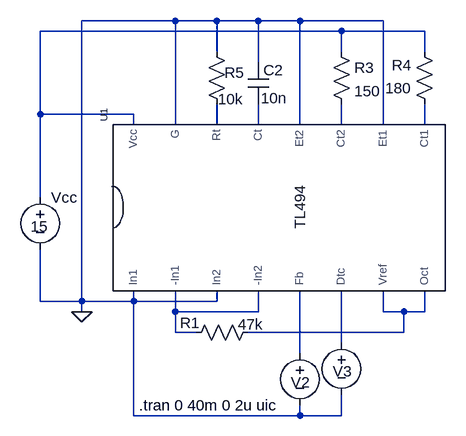
[diagram p0: schematic 494_test.asc]
494_test.asc, the LTspice schematic file:
Version 4
SHEET 1 880 764
WIRE -688 128 -832 128
WIRE -624 128 -688 128
WIRE -560 128 -624 128
WIRE -496 128 -560 128
WIRE -368 128 -496 128
WIRE -432 144 -896 144
WIRE -304 144 -432 144
WIRE -624 176 -624 128
WIRE -432 176 -432 144
WIRE -304 176 -304 144
WIRE -560 192 -560 128
WIRE -896 272 -896 144
WIRE -752 272 -896 272
WIRE -752 288 -752 272
WIRE -688 288 -688 128
WIRE -624 288 -624 256
WIRE -560 288 -560 256
WIRE -496 288 -496 128
WIRE -432 288 -432 256
WIRE -368 288 -368 128
WIRE -304 288 -304 256
WIRE -896 400 -896 272
WIRE -896 560 -896 480
WIRE -832 560 -832 128
WIRE -832 560 -896 560
WIRE -752 560 -752 544
WIRE -752 560 -832 560
WIRE -624 560 -624 544
WIRE -624 560 -752 560
WIRE -832 576 -832 560
WIRE -688 576 -688 544
WIRE -560 576 -560 544
WIRE -560 576 -688 576
WIRE -368 576 -368 544
WIRE -336 576 -368 576
WIRE -304 576 -304 544
WIRE -304 576 -336 576
WIRE -688 608 -688 576
WIRE -656 608 -688 608
WIRE -336 608 -336 576
WIRE -336 608 -576 608
WIRE -432 624 -432 544
WIRE -496 640 -496 544
WIRE -752 736 -752 560
WIRE -496 736 -496 720
WIRE -496 736 -752 736
WIRE -432 736 -432 704
WIRE -432 736 -496 736
FLAG -832 576 0
SYMBOL res -448 160 R0
SYMATTR InstName R3
SYMATTR Value 150
SYMBOL res -288 272 R180
WINDOW 0 36 76 Left 0
WINDOW 3 36 40 Left 0
SYMATTR InstName R4
SYMATTR Value 180
SYMBOL res -672 624 R270
WINDOW 0 15 7 VTop 0
WINDOW 3 44 100 VBottom 0
SYMATTR InstName R1
SYMATTR Value 47k
SYMBOL voltage -496 624 R0
WINDOW 3 24 104 Invisible 0
WINDOW 123 0 0 Left 0
WINDOW 39 0 0 Left 0
WINDOW 0 -14 61 Left 0
SYMATTR Value PULSE(0.7 5 10m 10m 50n 0 20m)
SYMATTR InstName V2
SYMBOL voltage -432 608 R0
WINDOW 3 24 104 Invisible 0
WINDOW 123 0 0 Left 0
WINDOW 39 0 0 Left 0
WINDOW 0 -13 60 Left 0
SYMATTR Value PULSE(0 5 0 10m 50n 0 20m)
SYMATTR InstName V3
SYMBOL res -640 160 R0
WINDOW 0 28 48 Left 0
WINDOW 3 18 89 Left 0
SYMATTR InstName R5
SYMATTR Value 10k
SYMBOL cap -576 192 R0
WINDOW 0 24 12 Left 0
WINDOW 3 20 55 Left 0
SYMATTR InstName C2
SYMATTR Value 10n
SYMBOL voltage -896 384 R0
WINDOW 123 0 0 Left 0
WINDOW 39 0 0 Left 0
WINDOW 0 17 16 Left 0
WINDOW 3 -15 61 Left 0
SYMATTR InstName Vcc
SYMATTR Value 15
SYMBOL TL494 -496 416 R270
SYMATTR InstName U1
TEXT -744 720 Left 0 !.tran 0 40m 0 2u uic

The netlist it stands for:
* 494_test.asc
R3 N001 N004 150
R4 N005 N001 180
R1 N006 N007 47k
V2 N009 0 PULSE(0.7 5 10m 10m 50n 0 20m)
V3 N008 0 PULSE(0 5 0 10m 50n 0 20m)
R5 0 N002 10k
C2 0 N003 10n
Vcc N001 0 15
XU1 0 N006 0 N006 N009 N008 N007 N007 N005 0 N004 0 N003 N002 0 N001 TL494  ; pins In1 -In1 In2 -In2 Fb Dtc Vref Oct Ct1 Et1 Ct2 Et2 Ct Rt G Vcc
.tran 0 40m 0 2u uic
.lib tl494.sub
.backanno
.end